# Altium schematic sheet adc.SchDoc
size A4
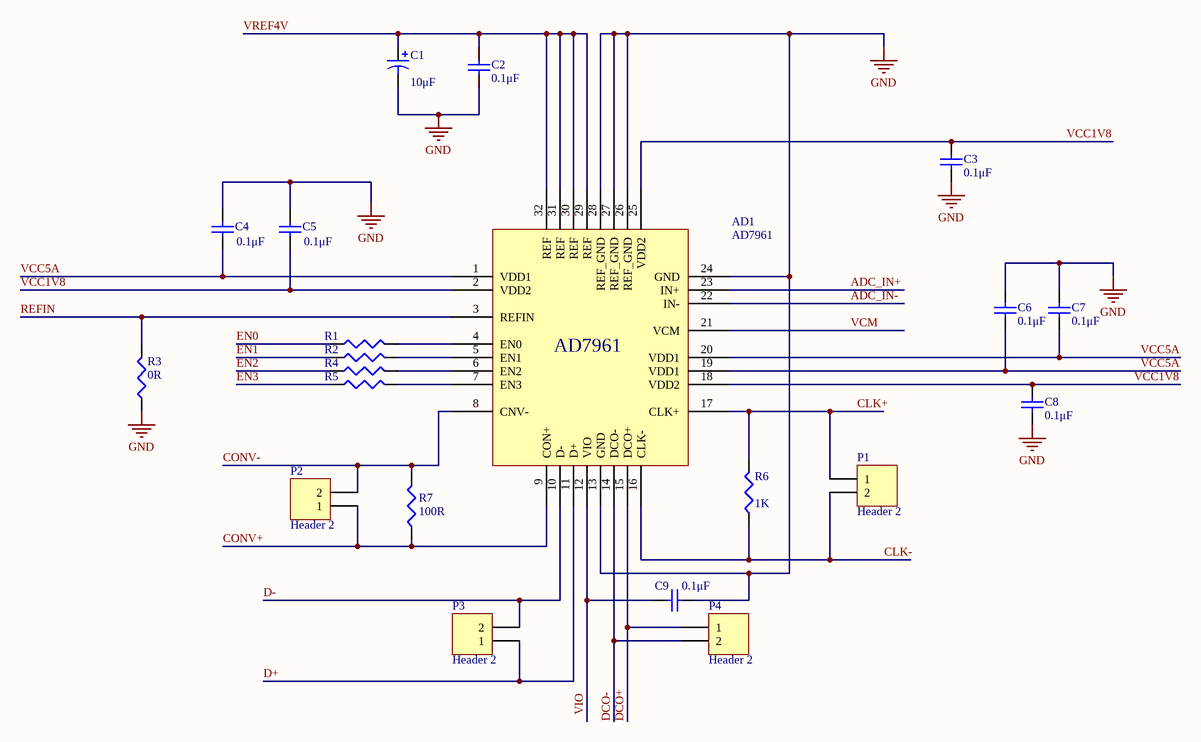
[diagram p0: adc.SchDoc]

## Parts
AD1  AD7961  [QFN50P500X500X80-33N]
C1  value 10μF  [C0805]  (hidden comment: Cap Pol3)
C2  value 0.1μF  [1608[0603]]  (hidden comment: Cap Semi)
C3  value 0.1μF  [1608[0603]]  (hidden comment: Cap Semi)
C4  value 0.1μF  [1608[0603]]  (hidden comment: Cap Semi)
C5  value 0.1μF  [1608[0603]]  (hidden comment: Cap Semi)
C6  value 0.1μF  [1608[0603]]  (hidden comment: Cap Semi)
C7  value 0.1μF  [1608[0603]]  (hidden comment: Cap Semi)
C8  value 0.1μF  [1608[0603]]  (hidden comment: Cap Semi)
C9  value 0.1μF  [1608[0603]]  (hidden comment: Cap Semi)
P1  Header 2  [HDR1X2]
P2  Header 2  [HDR1X2]
P3  Header 2  [HDR1X2]
P4  Header 2  [HDR1X2]
R1  Res3  [J1-0603]  (value not drawn)
R2  Res3  [J1-0603]  (value not drawn)
R3  0R  [J1-0603]
R4  Res3  [J1-0603]  (value not drawn)
R5  Res3  [J1-0603]  (value not drawn)
R6  value 1K  [J1-0603]  (hidden comment: Res3)
R7  value 100R  [J1-0603]  (hidden comment: Res3)

## Nets
GND: AD1.13(GND) AD1.24(GND) AD1.26(REF_GND) AD1.27(REF_GND) AD1.28(REF_GND) C1.2 C2.2 C3.2 C4.2 C5.2 C6.1 C7.1 C8.2 C9.1 R3.1
ADC_IN+: AD1.23(IN+)
ADC_IN-: AD1.22(IN-)
CLK+: AD1.17(CLK+) P1.1 R6.2
CLK-: AD1.16(CLK-) P1.2 R6.1
CONV+: AD1.9(CON+) P2.1 R7.1
CONV-: AD1.8(CNV-) P2.2 R7.2
D+: AD1.11(D+) P3.1
D-: AD1.10(D-) P3.2
DCO+: AD1.15(DCO+) P4.1
DCO-: AD1.14(DCO-) P4.2
EN0: R1.1
EN1: R2.1
EN2: R4.1
EN3: R5.1
REFIN: AD1.3(REFIN) R3.2
VCC1V8: AD1.2(VDD2) AD1.18(VDD2) AD1.25(VDD2) C3.1 C5.1 C8.1
VCC5A: AD1.1(VDD1) AD1.19(VDD1) AD1.20(VDD1) C4.1 C6.2 C7.2
VCM: AD1.21(VCM)
VIO: AD1.12(VIO) C9.2
VREF4V: AD1.29(REF) AD1.30(REF) AD1.31(REF) AD1.32(REF) C1.1 C2.1
NetAD1_4: AD1.4(EN0) R1.2
NetAD1_5: AD1.5(EN1) R2.2
NetAD1_6: AD1.6(EN2) R4.2
NetAD1_7: AD1.7(EN3) R5.2

## Library data of the parts
C1 = Cap Pol3: Polarized Capacitor (Surface Mount); Published: 8-Jun-2000; LatestRevisionDate: 29-May-2009; LatestRevisionNote: IPC-7351 Footprint Added.; PackageReference: C0805; Publisher: Altium Limited; PackageDescription: Chip Capacitor
C2-C9 = Cap Semi: Capacitor (Semiconductor SIM Model); Published: 8-Jun-2000; LatestRevisionDate: 29-May-2009; LatestRevisionNote: IPC-7351 Footprint Added.; PackageReference: C1206; Publisher: Altium Limited; PackageDescription: Chip Capacitor
P1-P4 = Header 2: Header, 2-Pin; LatestRevisionDate: 17-Jul-2002; LatestRevisionNote: Re-released for DXP Platform.; Publisher: Altium Limited
R1-R5 = Res3: Resistor; Value: 1K; Published: 8-Jun-2000; LatestRevisionDate: 29-May-2009; LatestRevisionNote: IPC-7351 Footprint Added.; PackageReference: J1-0603; Publisher: Altium Limited; PackageDescription: Chip Resistor
R6 R7 = Res3: Resistor; Published: 8-Jun-2000; LatestRevisionDate: 29-May-2009; LatestRevisionNote: IPC-7351 Footprint Added.; PackageReference: J1-0603; Publisher: Altium Limited; PackageDescription: Chip Resistor